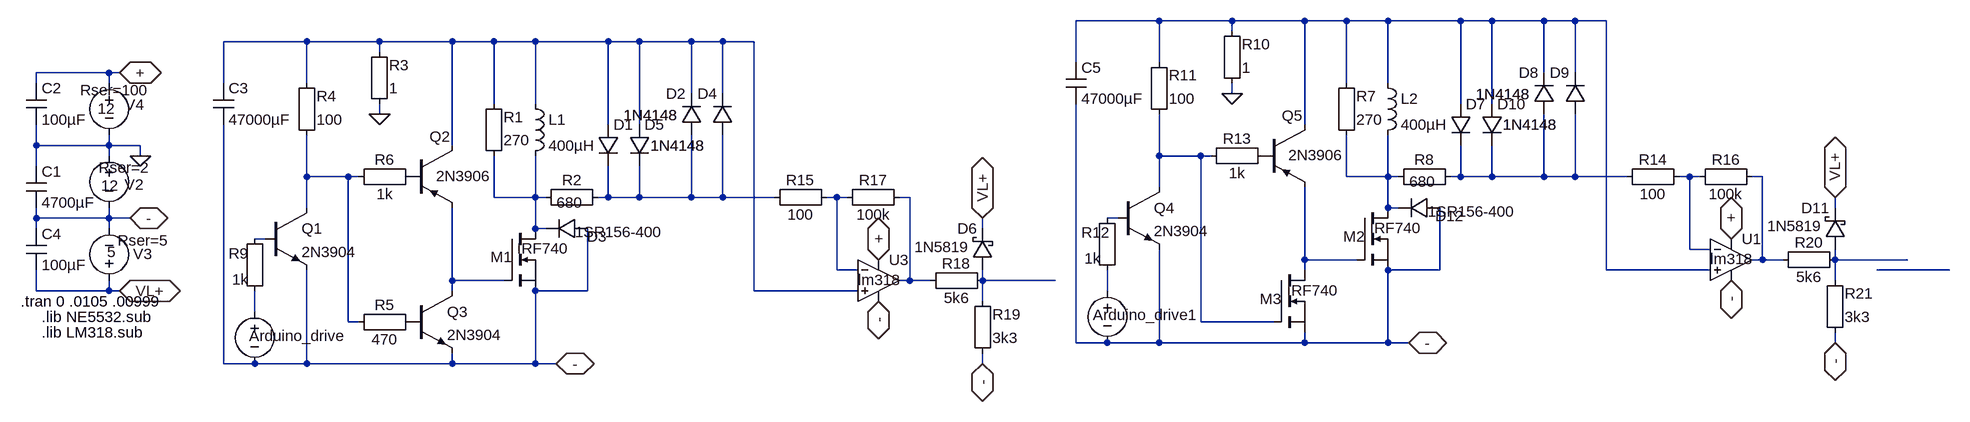
[diagram p0: schematic metal_1040.asc]
metal_1040.asc, the LTspice schematic file:
Version 4
SHEET 1 4676 1612
WIRE 1536 -2432 1408 -2432
WIRE 1648 -2432 1536 -2432
WIRE 1760 -2432 1648 -2432
WIRE 1824 -2432 1760 -2432
WIRE 1888 -2432 1824 -2432
WIRE 2000 -2432 1888 -2432
WIRE 2048 -2432 2000 -2432
WIRE 2128 -2432 2048 -2432
WIRE 2176 -2432 2128 -2432
WIRE 2224 -2432 2176 -2432
WIRE 1648 -2416 1648 -2432
WIRE 224 -2400 96 -2400
WIRE 336 -2400 224 -2400
WIRE 448 -2400 336 -2400
WIRE 512 -2400 448 -2400
WIRE 576 -2400 512 -2400
WIRE 688 -2400 576 -2400
WIRE 736 -2400 688 -2400
WIRE 816 -2400 736 -2400
WIRE 864 -2400 816 -2400
WIRE 912 -2400 864 -2400
WIRE 336 -2384 336 -2400
WIRE 1408 -2368 1408 -2432
WIRE 1536 -2368 1536 -2432
WIRE -80 -2352 -192 -2352
WIRE -64 -2352 -80 -2352
WIRE 2128 -2352 2128 -2432
WIRE 2176 -2352 2176 -2432
WIRE -192 -2336 -192 -2352
WIRE -80 -2336 -80 -2352
WIRE 96 -2336 96 -2400
WIRE 224 -2336 224 -2400
WIRE 1824 -2336 1824 -2432
WIRE 1888 -2336 1888 -2432
WIRE 816 -2320 816 -2400
WIRE 864 -2320 864 -2400
WIRE 1648 -2320 1648 -2336
WIRE 512 -2304 512 -2400
WIRE 576 -2304 576 -2400
WIRE 2000 -2304 2000 -2432
WIRE 2048 -2304 2048 -2432
WIRE 336 -2288 336 -2304
WIRE 688 -2272 688 -2400
WIRE 736 -2272 736 -2400
WIRE 1760 -2272 1760 -2432
WIRE -192 -2240 -192 -2272
WIRE -80 -2240 -80 -2256
WIRE -80 -2240 -192 -2240
WIRE -32 -2240 -80 -2240
WIRE 448 -2240 448 -2400
WIRE -80 -2224 -80 -2240
WIRE -32 -2224 -32 -2240
WIRE 1536 -2224 1536 -2288
WIRE 1600 -2224 1536 -2224
WIRE 1616 -2224 1600 -2224
WIRE -192 -2208 -192 -2240
WIRE 224 -2192 224 -2256
WIRE 288 -2192 224 -2192
WIRE 304 -2192 288 -2192
WIRE 1824 -2192 1824 -2256
WIRE 1888 -2192 1888 -2256
WIRE 1888 -2192 1824 -2192
WIRE 1904 -2192 1888 -2192
WIRE 2000 -2192 2000 -2240
WIRE 2000 -2192 1984 -2192
WIRE 2048 -2192 2048 -2240
WIRE 2048 -2192 2000 -2192
WIRE 2128 -2192 2128 -2288
WIRE 2128 -2192 2048 -2192
WIRE 2176 -2192 2176 -2288
WIRE 2176 -2192 2128 -2192
WIRE 2256 -2192 2176 -2192
WIRE 2352 -2192 2336 -2192
WIRE 2368 -2192 2352 -2192
WIRE 2464 -2192 2448 -2192
WIRE 1536 -2176 1536 -2224
WIRE 512 -2160 512 -2224
WIRE 576 -2160 576 -2224
WIRE 576 -2160 512 -2160
WIRE 592 -2160 576 -2160
WIRE 688 -2160 688 -2208
WIRE 688 -2160 672 -2160
WIRE 736 -2160 736 -2208
WIRE 736 -2160 688 -2160
WIRE 816 -2160 816 -2256
WIRE 816 -2160 736 -2160
WIRE 864 -2160 864 -2256
WIRE 864 -2160 816 -2160
WIRE 944 -2160 864 -2160
WIRE 1040 -2160 1024 -2160
WIRE 1056 -2160 1040 -2160
WIRE 1152 -2160 1136 -2160
WIRE 224 -2144 224 -2192
WIRE 1888 -2144 1888 -2192
WIRE 1904 -2144 1888 -2144
WIRE 2576 -2144 2576 -2160
WIRE -192 -2128 -192 -2144
WIRE -80 -2128 -80 -2144
WIRE -80 -2128 -192 -2128
WIRE -48 -2128 -80 -2128
WIRE 1472 -2128 1456 -2128
WIRE -192 -2112 -192 -2128
WIRE -80 -2112 -80 -2128
WIRE 576 -2112 576 -2160
WIRE 592 -2112 576 -2112
WIRE 1264 -2112 1264 -2128
WIRE 160 -2096 144 -2096
WIRE 2352 -2080 2352 -2192
WIRE 2384 -2080 2352 -2080
WIRE 1760 -2064 1760 -2176
WIRE 1840 -2064 1760 -2064
WIRE 2464 -2064 2464 -2192
WIRE 2464 -2064 2448 -2064
WIRE 2496 -2064 2464 -2064
WIRE 2576 -2064 2576 -2080
WIRE 2688 -2064 2576 -2064
WIRE 1040 -2048 1040 -2160
WIRE 1072 -2048 1040 -2048
WIRE 1760 -2048 1760 -2064
WIRE 1968 -2048 1968 -2144
WIRE 1968 -2048 1888 -2048
WIRE 2224 -2048 2224 -2432
WIRE 2384 -2048 2224 -2048
WIRE 2752 -2048 2640 -2048
WIRE 448 -2032 448 -2144
WIRE 528 -2032 448 -2032
WIRE 1152 -2032 1152 -2160
WIRE 1152 -2032 1136 -2032
WIRE 1184 -2032 1152 -2032
WIRE 1264 -2032 1264 -2048
WIRE 1376 -2032 1264 -2032
WIRE 2576 -2032 2576 -2064
WIRE -192 -2016 -192 -2048
WIRE -80 -2016 -80 -2032
WIRE -80 -2016 -192 -2016
WIRE -64 -2016 -80 -2016
WIRE 448 -2016 448 -2032
WIRE 656 -2016 656 -2112
WIRE 656 -2016 576 -2016
WIRE 912 -2016 912 -2400
WIRE 1072 -2016 912 -2016
WIRE 1456 -2016 1456 -2048
WIRE 1264 -2000 1264 -2032
WIRE 144 -1984 144 -2016
WIRE 288 -1968 288 -2192
WIRE 304 -1968 288 -1968
WIRE 1600 -1968 1600 -2224
WIRE 1712 -1968 1600 -1968
WIRE 1408 -1936 1408 -2304
WIRE 1456 -1936 1408 -1936
WIRE 1536 -1936 1536 -2080
WIRE 1536 -1936 1456 -1936
WIRE 1760 -1936 1760 -1952
WIRE 1760 -1936 1536 -1936
WIRE 1888 -1936 1888 -2048
WIRE 1888 -1936 1760 -1936
WIRE 1920 -1936 1888 -1936
WIRE 2576 -1936 2576 -1952
WIRE 96 -1904 96 -2272
WIRE 144 -1904 96 -1904
WIRE 224 -1904 224 -2048
WIRE 224 -1904 144 -1904
WIRE 448 -1904 448 -1920
WIRE 448 -1904 224 -1904
WIRE 576 -1904 576 -2016
WIRE 576 -1904 448 -1904
WIRE 608 -1904 576 -1904
WIRE 1264 -1904 1264 -1920
FLAG 608 -1904 -
IOPIN 608 -1904 BiDir
FLAG -48 -2128 -
IOPIN -48 -2128 BiDir
FLAG -64 -2352 +
IOPIN -64 -2352 BiDir
FLAG -32 -2224 0
FLAG 336 -2288 0
FLAG -64 -2016 VL+
IOPIN -64 -2016 BiDir
FLAG 1104 -2064 +
IOPIN 1104 -2064 BiDir
FLAG 1104 -2000 -
IOPIN 1104 -2000 BiDir
FLAG 1264 -1904 -
IOPIN 1264 -1904 BiDir
FLAG 1264 -2128 VL+
IOPIN 1264 -2128 BiDir
FLAG 1920 -1936 -
IOPIN 1920 -1936 BiDir
FLAG 1648 -2320 0
FLAG 2416 -2096 +
IOPIN 2416 -2096 BiDir
FLAG 2416 -2032 -
IOPIN 2416 -2032 BiDir
FLAG 2576 -1936 -
IOPIN 2576 -1936 BiDir
FLAG 2576 -2160 VL+
IOPIN 2576 -2160 BiDir
SYMBOL Misc\\EuropeanCap 80 -2336 R0
SYMATTR InstName C3
SYMATTR Value 47000µF
SYMATTR SpiceLine V=400 Irms=1 Rser=.32 Lser=0
SYMBOL ind 560 -2320 R0
SYMATTR InstName L1
SYMATTR Value 400µH
SYMATTR SpiceLine Rser=.5 Cpar=1n
SYMBOL Misc\\EuropeanResistor 496 -2208 M180
WINDOW 0 31 76 Left 2
WINDOW 3 31 40 Left 2
SYMATTR InstName R1
SYMATTR Value 270
SYMBOL Misc\\EuropeanResistor 576 -2176 M90
WINDOW 0 5 56 VBottom 2
WINDOW 3 8 53 VTop 2
SYMATTR InstName R2
SYMATTR Value 680
SYMBOL diode 672 -2272 R0
WINDOW 3 81 32 Left 2
SYMATTR Value 1N4148
SYMATTR InstName D1
SYMBOL diode 832 -2256 R180
WINDOW 0 24 64 Left 2
WINDOW 3 36 31 Left 2
SYMATTR InstName D2
SYMATTR Value 1N4148
SYMBOL Misc\\EuropeanResistor 320 -2288 M180
WINDOW 0 31 76 Left 2
WINDOW 3 31 40 Left 2
SYMATTR InstName R3
SYMATTR Value 1
SYMBOL nmos 528 -2112 R0
WINDOW 0 -21 44 Left 2
WINDOW 3 20 31 Left 2
SYMATTR InstName M1
SYMATTR Value IRF740
SYMBOL voltage 144 -2000 M0
WINDOW 0 -141 53 Left 2
WINDOW 3 -134 119 Invisible 2
SYMATTR InstName Arduino_drive
SYMATTR Value PULSE(0 4 .01 0 0 .00025 .1 1000)
SYMATTR SpiceLine Rser=0
SYMBOL voltage -80 -2240 M0
WINDOW 123 0 0 Left 2
WINDOW 39 -63 34 Left 2
WINDOW 0 -53 60 Left 2
WINDOW 3 -15 62 Left 2
SYMATTR SpiceLine Rser=2
SYMATTR InstName V2
SYMATTR Value 12
SYMBOL voltage -80 -2352 M0
WINDOW 123 0 0 Left 2
WINDOW 39 -61 27 Left 2
WINDOW 0 -54 49 Left 2
WINDOW 3 -9 55 Left 2
SYMATTR SpiceLine Rser=100
SYMATTR InstName V4
SYMATTR Value 12
SYMBOL voltage -80 -2016 M180
WINDOW 123 0 0 Left 2
WINDOW 39 13 78 Left 2
WINDOW 0 37 57 Left 2
WINDOW 3 -3 60 Left 2
SYMATTR SpiceLine Rser=5
SYMATTR InstName V3
SYMATTR Value 5
SYMBOL npn3 160 -2144 R0
SYMATTR InstName Q1
SYMATTR Value 2N3904
SYMBOL Misc\\EuropeanResistor 208 -2240 M180
WINDOW 0 31 76 Left 2
WINDOW 3 31 40 Left 2
SYMATTR InstName R4
SYMATTR Value 100
SYMBOL pnp2 384 -2240 R0
WINDOW 0 29 -14 Left 2
WINDOW 3 39 47 Left 2
SYMATTR InstName Q2
SYMATTR Value 2N3906
SYMBOL Misc\\EuropeanResistor 128 -2000 M180
WINDOW 0 -24 74 Left 2
WINDOW 3 -19 34 Left 2
SYMATTR InstName R9
SYMATTR Value 1k
SYMBOL Misc\\EuropeanResistor 288 -2208 M90
WINDOW 0 5 56 VBottom 2
WINDOW 3 27 56 VTop 2
SYMATTR InstName R6
SYMATTR Value 1k
SYMBOL diode 880 -2256 R180
WINDOW 0 24 64 Left 2
WINDOW 3 84 31 Left 2
SYMATTR InstName D4
SYMATTR Value 1N4148
SYMBOL diode 720 -2272 R0
WINDOW 3 33 32 Left 2
SYMATTR Value 1N4148
SYMATTR InstName D5
SYMBOL Misc\\EuropeanCap -208 -2208 R0
SYMATTR InstName C1
SYMATTR Value 4700µF
SYMATTR SpiceLine V=400 Irms=1 Rser=.32 Lser=0
SYMBOL Misc\\EuropeanCap -208 -2336 R0
SYMATTR InstName C2
SYMATTR Value 100µF
SYMATTR SpiceLine V=400 Irms=1 Rser=.32 Lser=0
SYMBOL Misc\\EuropeanCap -208 -2112 R0
SYMATTR InstName C4
SYMATTR Value 100µF
SYMATTR SpiceLine V=400 Irms=1 Rser=.32 Lser=0
SYMBOL Opamps\\opamp2 1104 -2096 R0
WINDOW 3 -32 63 Left 2
SYMATTR Value lm318
SYMATTR InstName U3
SYMBOL Misc\\EuropeanResistor 928 -2144 R270
WINDOW 0 27 56 VTop 2
WINDOW 3 5 56 VBottom 2
SYMATTR InstName R15
SYMATTR Value 100
SYMBOL Misc\\EuropeanResistor 1040 -2144 R270
WINDOW 0 27 56 VTop 2
WINDOW 3 5 56 VBottom 2
SYMATTR InstName R17
SYMATTR Value 100k
SYMBOL Misc\\EuropeanResistor 1168 -2016 R270
WINDOW 0 27 56 VTop 2
WINDOW 3 5 56 VBottom 2
SYMATTR InstName R18
SYMATTR Value 5k6
SYMBOL Misc\\EuropeanResistor 1248 -1904 M180
WINDOW 0 31 76 Left 2
WINDOW 3 31 40 Left 2
SYMATTR InstName R19
SYMATTR Value 3k3
SYMBOL schottky 1280 -2048 R180
WINDOW 0 24 64 Left 2
WINDOW 3 36 36 Left 2
SYMATTR InstName D6
SYMATTR Value 1N5819
SYMATTR Description Diode
SYMATTR Type diode
SYMBOL npn3 384 -2016 R0
SYMATTR InstName Q3
SYMATTR Value 2N3904
SYMBOL Misc\\EuropeanResistor 288 -1984 M90
WINDOW 0 5 56 VBottom 2
WINDOW 3 27 56 VTop 2
SYMATTR InstName R5
SYMATTR Value 470
SYMBOL diode 656 -2128 R90
WINDOW 0 44 -15 VBottom 2
WINDOW 3 6 -49 VTop 2
SYMATTR InstName D3
SYMATTR Value 1SR156-400
SYMATTR Description Zener Diode
SYMATTR Type zener
SYMBOL Misc\\EuropeanCap 1392 -2368 R0
SYMATTR InstName C5
SYMATTR Value 47000µF
SYMATTR SpiceLine V=400 Irms=1 Rser=.32 Lser=0
SYMBOL ind 1872 -2352 R0
SYMATTR InstName L2
SYMATTR Value 400µH
SYMATTR SpiceLine Rser=.5 Cpar=1n
SYMBOL Misc\\EuropeanResistor 1808 -2240 M180
WINDOW 0 31 76 Left 2
WINDOW 3 31 40 Left 2
SYMATTR InstName R7
SYMATTR Value 270
SYMBOL Misc\\EuropeanResistor 1888 -2208 M90
WINDOW 0 5 56 VBottom 2
WINDOW 3 8 53 VTop 2
SYMATTR InstName R8
SYMATTR Value 680
SYMBOL diode 1984 -2304 R0
WINDOW 3 81 32 Left 2
SYMATTR Value 1N4148
SYMATTR InstName D7
SYMBOL diode 2144 -2288 R180
WINDOW 0 24 64 Left 2
WINDOW 3 36 31 Left 2
SYMATTR InstName D8
SYMATTR Value 1N4148
SYMBOL Misc\\EuropeanResistor 1632 -2320 M180
WINDOW 0 31 76 Left 2
WINDOW 3 31 40 Left 2
SYMATTR InstName R10
SYMATTR Value 1
SYMBOL nmos 1840 -2144 R0
WINDOW 0 -21 44 Left 2
WINDOW 3 20 31 Left 2
SYMATTR InstName M2
SYMATTR Value IRF740
SYMBOL voltage 1456 -2032 M0
WINDOW 0 -141 53 Left 2
WINDOW 3 -134 119 Invisible 2
SYMATTR InstName Arduino_drive1
SYMATTR Value PULSE(0 4 .01 0 0 .00025 .1 1000)
SYMATTR SpiceLine Rser=0
SYMBOL npn3 1472 -2176 R0
SYMATTR InstName Q4
SYMATTR Value 2N3904
SYMBOL Misc\\EuropeanResistor 1520 -2272 M180
WINDOW 0 31 76 Left 2
WINDOW 3 31 40 Left 2
SYMATTR InstName R11
SYMATTR Value 100
SYMBOL pnp2 1696 -2272 R0
WINDOW 0 29 -14 Left 2
WINDOW 3 39 47 Left 2
SYMATTR InstName Q5
SYMATTR Value 2N3906
SYMBOL Misc\\EuropeanResistor 1440 -2032 M180
WINDOW 0 -24 74 Left 2
WINDOW 3 -19 34 Left 2
SYMATTR InstName R12
SYMATTR Value 1k
SYMBOL Misc\\EuropeanResistor 1600 -2240 M90
WINDOW 0 5 56 VBottom 2
WINDOW 3 27 56 VTop 2
SYMATTR InstName R13
SYMATTR Value 1k
SYMBOL diode 2192 -2288 R180
WINDOW 0 24 64 Left 2
WINDOW 3 84 31 Left 2
SYMATTR InstName D9
SYMATTR Value 1N4148
SYMBOL diode 2032 -2304 R0
WINDOW 3 33 32 Left 2
SYMATTR Value 1N4148
SYMATTR InstName D10
SYMBOL Opamps\\opamp2 2416 -2128 R0
WINDOW 3 -32 63 Left 2
SYMATTR Value lm318
SYMATTR InstName U1
SYMBOL Misc\\EuropeanResistor 2240 -2176 R270
WINDOW 0 27 56 VTop 2
WINDOW 3 5 56 VBottom 2
SYMATTR InstName R14
SYMATTR Value 100
SYMBOL Misc\\EuropeanResistor 2352 -2176 R270
WINDOW 0 27 56 VTop 2
WINDOW 3 5 56 VBottom 2
SYMATTR InstName R16
SYMATTR Value 100k
SYMBOL Misc\\EuropeanResistor 2480 -2048 R270
WINDOW 0 27 56 VTop 2
WINDOW 3 5 56 VBottom 2
SYMATTR InstName R20
SYMATTR Value 5k6
SYMBOL Misc\\EuropeanResistor 2560 -1936 M180
WINDOW 0 31 76 Left 2
WINDOW 3 31 40 Left 2
SYMATTR InstName R21
SYMATTR Value 3k3
SYMBOL schottky 2592 -2080 R180
WINDOW 0 24 64 Left 2
WINDOW 3 36 36 Left 2
SYMATTR InstName D11
SYMATTR Value 1N5819
SYMATTR Description Diode
SYMATTR Type diode
SYMBOL diode 1968 -2160 R90
WINDOW 0 44 -15 VBottom 2
WINDOW 3 6 -49 VTop 2
SYMATTR InstName D12
SYMATTR Value 1SR156-400
SYMATTR Description Zener Diode
SYMATTR Type zener
SYMBOL nmos 1712 -2048 R0
WINDOW 0 -21 44 Left 2
WINDOW 3 20 31 Left 2
SYMATTR InstName M3
SYMATTR Value IRF740
TEXT -216 -2000 Left 2 !.tran 0 .0105 .00999
TEXT -184 -1976 Left 2 !.lib NE5532.sub
TEXT -184 -1952 Left 2 !.lib LM318.sub

The netlist it stands for:
* metal_1040.asc
C3 N002 - 47000µF V=400 Irms=1 Rser=.32 Lser=0
L1 N002 N009 400µH Rser=.5 Cpar=1n
R1 N009 N002 270
R2 N009 N010 680
D1 N002 N010 1N4148
D2 N010 N002 1N4148
R3 0 N002 1
M1 N009 N018 - - IRF740
V§Arduino_drive N021 - PULSE(0 4 .01 0 0 .00025 .1 1000) Rser=0
V2 0 - 12 Rser=2
V4 + 0 12 Rser=100
V3 VL+ - 5 Rser=5
Q1 N004 N014 - 0 2N3904
R4 N004 N002 100
Q2 N002 P001 N018 0 2N3906
R9 N021 N014 1k
R6 N004 P001 1k
D4 N010 N002 1N4148
D5 N002 N010 1N4148
C1 0 - 4700µF V=400 Irms=1 Rser=.32 Lser=0
C2 + 0 100µF V=400 Irms=1 Rser=.32 Lser=0
C4 - VL+ 100µF V=400 Irms=1 Rser=.32 Lser=0
XU3 N002 N011 + - N012 lm318  ; pins In+ In- V+ V- OUT
R15 N010 N011 100
R17 N011 N012 100k
R18 N012 N019 5k6
R19 - N019 3k3
D6 N019 VL+ 1N5819
Q3 N018 P002 - 0 2N3904
R5 N004 P002 470
D3 - N009 1SR156-400
C5 N001 - 47000µF V=400 Irms=1 Rser=.32 Lser=0
L2 N001 N005 400µH Rser=.5 Cpar=1n
R7 N005 N001 270
R8 N005 N006 680
D7 N001 N006 1N4148
D8 N006 N001 1N4148
R10 0 N001 1
M2 N005 N015 - - IRF740
V§Arduino_drive1 N020 - PULSE(0 4 .01 0 0 .00025 .1 1000) Rser=0
Q4 N003 N013 - 0 2N3904
R11 N003 N001 100
Q5 N001 P003 N015 0 2N3906
R12 N020 N013 1k
R13 N003 P003 1k
D9 N006 N001 1N4148
D10 N001 N006 1N4148
XU1 N001 N007 + - N008 lm318  ; pins In+ In- V+ V- OUT
R14 N006 N007 100
R16 N007 N008 100k
R20 N008 N016 5k6
R21 - N016 3k3
D11 N016 VL+ 1N5819
D12 - N005 1SR156-400
M3 N015 N003 - - IRF740
.model D D
.lib standard.dio
.model NPN NPN
.model PNP PNP
.lib standard.bjt
.model NMOS NMOS
.model PMOS PMOS
.lib standard.mos
.tran 0 .0105 .00999
.lib NE5532.sub
.lib LM318.sub
.backanno
.end